# Altium schematic sheet BOOST.SchDoc
size A4; SheetNumber: 2; SheetTotal: 2
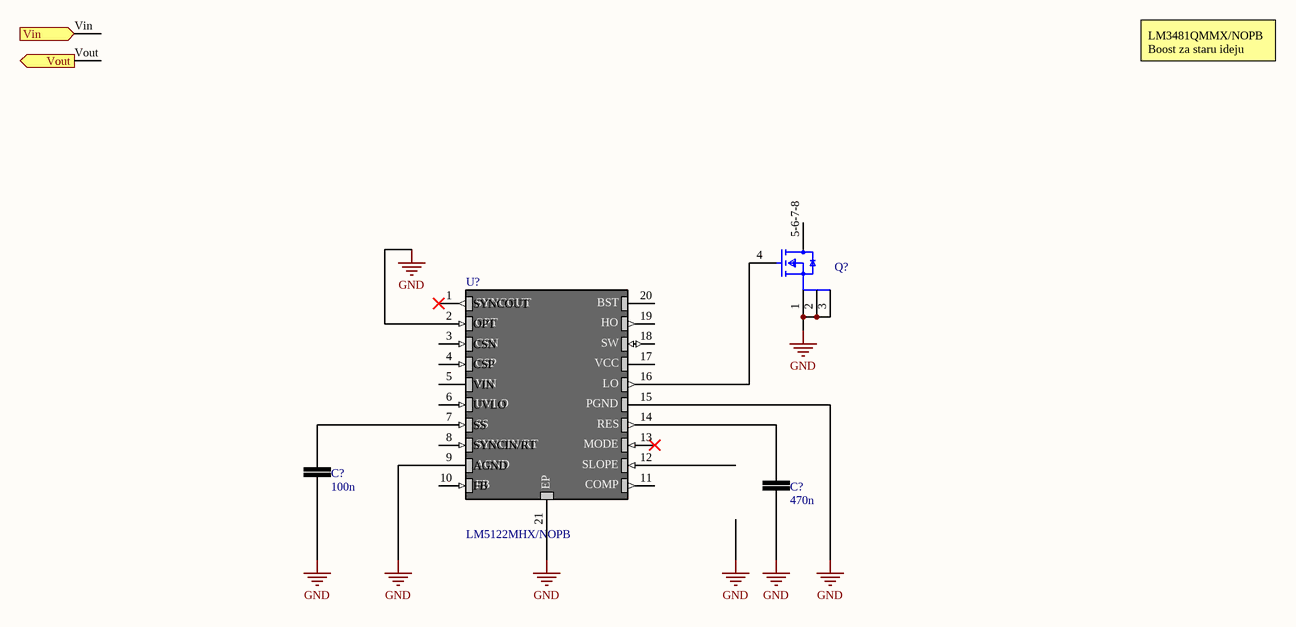
[diagram p0: BOOST.SchDoc]

## Parts
(Parts that share a designator on the sheet are numbered #1, #2 ... from top to bottom, then left to right.)
C?#1  100n  [CAP_0805]
C?#2  470n  [CAP_0805]
Q?  IRFH7084TRPBF  [FP-PQFN5x6-G-MFG]  (value not drawn)
U?  LM5122MHX/NOPB  [SOP65P640X110-21N]

## Ports
Vin (in), Vout (out)

## Nets
GND: C?#1.1 C?#2.2 Q?.1(S) Q?.2(S) Q?.3(S) U?.2(OPT) U?.9(AGND) U?.15(PGND) U?.21(EP)
Vin: port Vin
Vout: port Vout
NetC?#1_2: C?#1.2 U?.7(SS)
NetC?#2_1: C?#2.1 U?.14(RES)
NetQ?_4: Q?.4(G) U?.16(LO)

Not connected (* = marked no-connect by the designer): Q? 5-6-7-8(D); U? 1(SYNCOUT)* 3(CSN) 4(CSP) 5(VIN) 6(UVLO) 8(SYNCIN/RT) 10(FB) 11(COMP) 12(SLOPE) 13(MODE)* 17(VCC) 18(SW) 19(HO) 20(BST)

## Notes on the sheet
- LM3481QMMX/NOPB
  Boost za staru ideju

## Library data of the parts
C?#1 = C00079: CAP 100nF ±10% 50V 0805 X7R; capacitance: 100n
C?#2 = C00081: CAP 470nF ±10% 25V 0805 X7R; capacitance: 470n
Q? = CMP-32901-000490-1: MOSFET N-CH 40V 100A 8QFN; Input Capacitance: 6.56nF; Threshold Voltage: 3.9V; Rds On Max: 1.25mR; Mount: Surface Mount; Drain to Source Voltage (Vdss): 40V; Max Operating Temperature: 150°C; Continuous Drain Current (ID): 100A; Min Operating Temperature: -55°C; Packaging: Tape and Reel; Max Dual Supply Voltage: 40V; Number of Pins: 8; Lead Free: Lead Free; Halogen Free: Halogen Free; REACH SVHC: No SVHC
U? = LM5122MHX/NOPB: 3-65V Wide Vin, Current Mode Synchronous Boost Controller with Multiphase Capability; MF: Texas Instruments; SnapEDA_Link: https://www.snapeda.com/parts/LM5122MHX/NOPB/Texas+Instruments/view-part/?ref=snap; Package: HTSSOP-20 Texas Instruments; Value: *; MP: LM5122MHX/NOPB; Check_prices: https://www.snapeda.com/parts/LM5122MHX/NOPB/Texas+Instruments/view-part/?ref=eda